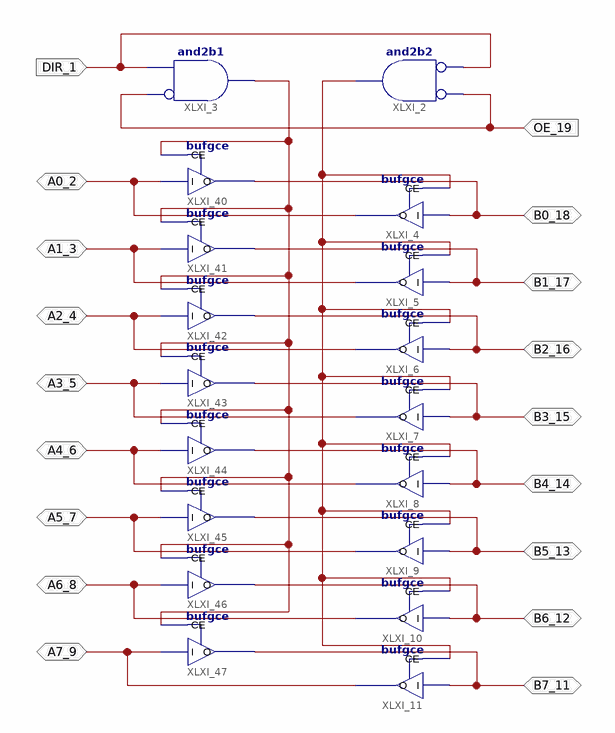
[diagram p0: schematic sheet 1]
// Xilinx ISE schematic A245.sch (spartan6) as structural Verilog: 18 symbols, 18 ports
module A245 (
  input  DIR_1,
  input  OE_19,
  inout  B0_18,
  inout  B1_17,
  inout  B2_16,
  inout  B3_15,
  inout  B4_14,
  inout  B5_13,
  inout  B6_12,
  inout  B7_11,
  inout  A7_9,
  inout  A6_8,
  inout  A5_7,
  inout  A4_6,
  inout  A3_5,
  inout  A2_4,
  inout  A1_3,
  inout  A0_2
);

  wire XLXN_11, XLXN_12;

  and XLXI_2 (XLXN_12, ~OE_19, ~DIR_1);  // and2b2
  and XLXI_3 (XLXN_11, ~OE_19, DIR_1);  // and2b1
  bufgce XLXI_40 (.CE(XLXN_11), .I(A0_2), .O(B0_18));
  bufgce XLXI_41 (.CE(XLXN_11), .I(A1_3), .O(B1_17));
  bufgce XLXI_42 (.CE(XLXN_11), .I(A2_4), .O(B2_16));
  bufgce XLXI_43 (.CE(XLXN_11), .I(A3_5), .O(B3_15));
  bufgce XLXI_44 (.CE(XLXN_11), .I(A4_6), .O(B4_14));
  bufgce XLXI_45 (.CE(XLXN_11), .I(A5_7), .O(B5_13));
  bufgce XLXI_46 (.CE(XLXN_11), .I(A6_8), .O(B6_12));
  bufgce XLXI_47 (.CE(XLXN_11), .I(A7_9), .O(B7_11));
  bufgce XLXI_4 (.CE(XLXN_12), .I(B0_18), .O(A0_2));
  bufgce XLXI_5 (.CE(XLXN_12), .I(B1_17), .O(A1_3));
  bufgce XLXI_6 (.CE(XLXN_12), .I(B2_16), .O(A2_4));
  bufgce XLXI_7 (.CE(XLXN_12), .I(B3_15), .O(A3_5));
  bufgce XLXI_8 (.CE(XLXN_12), .I(B4_14), .O(A4_6));
  bufgce XLXI_9 (.CE(XLXN_12), .I(B5_13), .O(A5_7));
  bufgce XLXI_10 (.CE(XLXN_12), .I(B6_12), .O(A6_8));
  bufgce XLXI_11 (.CE(XLXN_12), .I(B7_11), .O(A7_9));
endmodule
